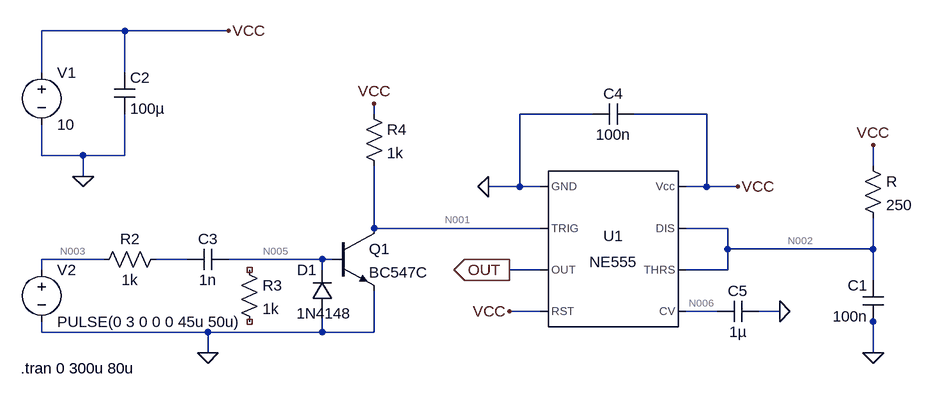
[diagram p0: schematic monostabilny.asc]
monostabilny.asc, the LTspice schematic file:
Version 4
SHEET 1 880 680
WIRE -528 -192 -656 -192
WIRE -368 -192 -528 -192
WIRE -656 -128 -656 -192
WIRE -528 -128 -528 -192
WIRE -144 -64 -144 -80
WIRE 192 -64 80 -64
WIRE 368 -64 256 -64
WIRE -656 0 -656 -48
WIRE -592 0 -656 0
WIRE -528 0 -528 -64
WIRE -528 0 -592 0
WIRE 624 16 624 -16
WIRE -592 32 -592 0
WIRE 80 48 80 -64
WIRE 80 48 32 48
WIRE 112 48 80 48
WIRE 368 48 368 -64
WIRE 368 48 336 48
WIRE 416 48 368 48
WIRE -144 112 -144 16
WIRE 112 112 -144 112
WIRE 400 112 336 112
WIRE 400 144 400 112
WIRE 624 144 624 96
WIRE 624 144 400 144
WIRE -560 160 -656 160
WIRE -432 160 -480 160
WIRE -224 160 -368 160
WIRE -208 160 -224 160
WIRE -656 176 -656 160
WIRE -224 176 -224 160
WIRE 112 176 64 176
WIRE 400 176 400 144
WIRE 400 176 336 176
WIRE 624 192 624 144
WIRE 112 240 64 240
WIRE 384 240 336 240
WIRE 480 240 448 240
WIRE 624 256 624 240
WIRE -656 272 -656 256
WIRE -400 272 -656 272
WIRE -224 272 -224 240
WIRE -224 272 -400 272
WIRE -144 272 -144 208
WIRE -144 272 -224 272
WIRE -400 304 -400 272
WIRE 624 304 624 256
FLAG 624 304 0
FLAG 64 176 OUT
IOPIN 64 176 Out
FLAG -592 32 0
FLAG -368 -192 VCC
FLAG 64 240 VCC
FLAG -400 304 0
FLAG -144 -80 VCC
FLAG 32 48 0
FLAG 416 48 VCC
FLAG 480 240 0
FLAG 624 -16 VCC
SYMBOL Misc\\NE555 224 144 R0
SYMATTR InstName U1
SYMBOL cap 640 256 R180
WINDOW 0 24 56 Left 2
WINDOW 3 24 8 Left 2
SYMATTR InstName C1
SYMATTR Value 100n
SYMBOL res 608 0 R0
SYMATTR InstName R
SYMATTR Value 250
SYMBOL npn -208 112 R0
SYMATTR InstName Q1
SYMATTR Value BC547C
SYMBOL voltage -656 -144 R0
WINDOW 123 0 0 Left 0
WINDOW 39 0 0 Left 0
SYMATTR InstName V1
SYMATTR Value 10
SYMBOL cap -544 -128 R0
SYMATTR InstName C2
SYMATTR Value 100µ
SYMBOL voltage -656 160 R0
WINDOW 123 0 0 Left 0
WINDOW 39 0 0 Left 0
SYMATTR InstName V2
SYMATTR Value PULSE(0 3 0 0 0 45u 50u)
SYMBOL res -464 144 R90
WINDOW 0 0 56 VBottom 2
WINDOW 3 32 56 VTop 2
SYMATTR InstName R2
SYMATTR Value 1k
SYMBOL cap -368 144 R90
WINDOW 0 0 32 VBottom 2
WINDOW 3 32 32 VTop 2
SYMATTR InstName C3
SYMATTR Value 1n
SYMBOL res -352 160 R0
SYMATTR InstName R3
SYMATTR Value 1k
SYMBOL diode -208 240 R180
WINDOW 0 24 64 Left 2
WINDOW 3 -29 -3 Left 2
SYMATTR InstName D1
SYMATTR Value 1N4148
SYMBOL res -160 -80 R0
SYMATTR InstName R4
SYMATTR Value 1k
SYMBOL cap 256 -80 R90
WINDOW 0 0 32 VBottom 2
WINDOW 3 32 32 VTop 2
SYMATTR InstName C4
SYMATTR Value 100n
SYMBOL cap 448 224 R90
WINDOW 0 0 32 VBottom 2
WINDOW 3 32 32 VTop 2
SYMATTR InstName C5
SYMATTR Value 1µ
TEXT -688 328 Left 2 !.tran 0 300u 80u

The netlist it stands for:
* monostabilny.asc
XU1 0 N001 OUT VCC N006 N002 N002 VCC NE555  ; pins GND TRIG OUT RST CV THRS DIS Vcc
C1 0 N002 100n
R VCC N002 250
Q1 N001 N005 0 0 BC547C
V1 VCC 0 10
C2 VCC 0 100µ
V2 N003 0 PULSE(0 3 0 0 0 45u 50u)
R2 N004 N003 1k
C3 N005 N004 1n
R3 NC_01 NC_02 1k
D1 0 N005 1N4148
R4 VCC N001 1k
C4 VCC 0 100n
C5 0 N006 1µ
.model D D
.lib standard.dio
.model NPN NPN
.model PNP PNP
.lib standard.bjt
.tran 0 300u 80u
.lib NE555.sub
.backanno
.end

* Results of the author's LTspice run, read from the files saved beside the schematic
* Operating Point, zero values left out:
*   V(n001) = 10 V
*   V(n006) = 6.667 V
*   V(vcc) = 10 V
*   V(n002) = 10 V
*   V(out) = 10 V
*   V(n005) = 180.7 µV
*   Ic(Q1) = 10.08 pA
*   Ib(Q1) = -10.03 pA
*   I(D1) = -10.03 pA
*   I(R4) = 10.01 nA
*   I(R) = 23.34 nA
*   I(V1) = -3.233 mA
*   Ix(u1:1) = -3.233 mA
*   Ix(u1:2) = 10 nA
*   Ix(u1:4) = 56 µA
*   Ix(u1:6) = 10 nA
*   Ix(u1:7) = 13.34 nA
*   Ix(u1:8) = 3.177 mA
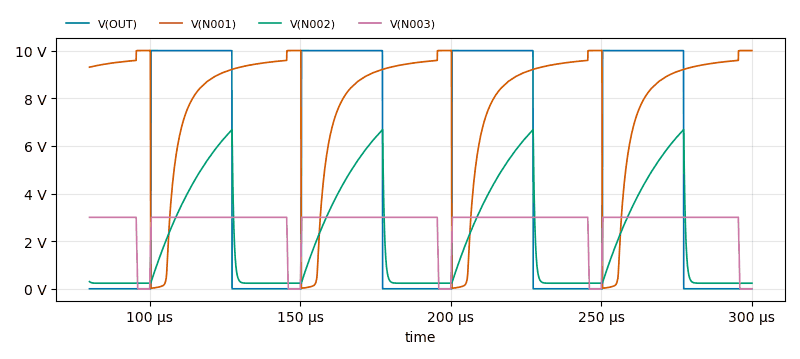
[diagram p1: Transient Analysis of monostabilny.asc, plotted from the saved traces]
* Transient Analysis, 1 run:
*   V(OUT): min 60 µV, max 10 V, average 4.897 V, rms 6.996 V, last 60 µV
*   V(N001): min 25.76 mV, max 10.01 V, average 7.862 V, rms 8.404 V, last 10 V
*   V(N002): min 234.4 mV, max 6.684 V, average 2.168 V, rms 3.152 V, last 234.4 mV
*   V(N003): min 0 V, max 3 V, average 2.697 V, rms 2.839 V, last 0 V